# EAGLE design PCB1 (EAGLE 9.3.0)
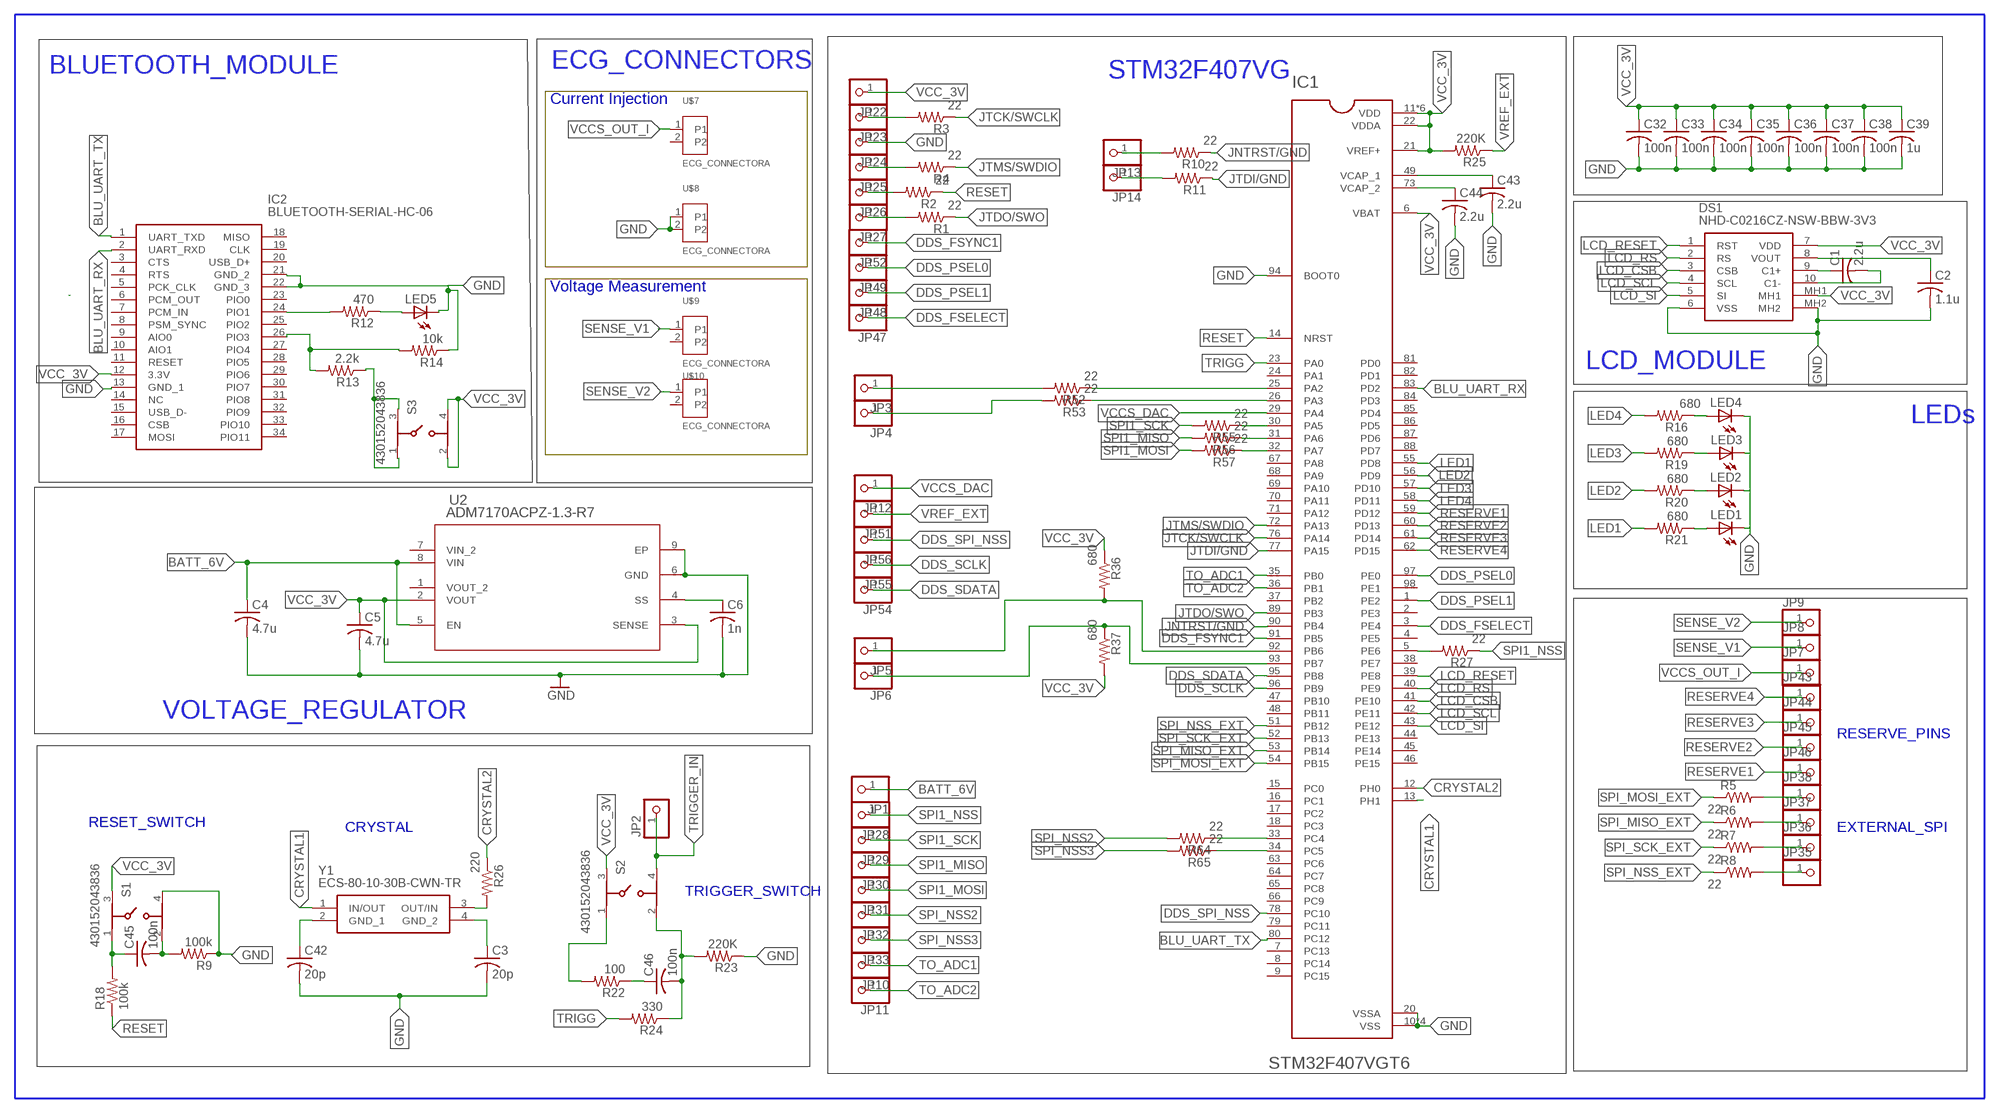
[diagram p0: schematic, sheet 1]

## Parts
C1  2.2u  C-USC0603  [C0603]
C2  1.1u  C-USC0603  [C0603]
C3  20p  C-USC0603  [C0603]
C4  4.7u  C-USC0603  [C0603]
C5  4.7u  C-USC0603  [C0603]
C6  1n  C-USC0603  [C0603]
C32  100n  C-USC0603  [C0603]
C33  100n  C-USC0603  [C0603]
C34  100n  C-USC0603  [C0603]
C35  100n  C-USC0603  [C0603]
C36  100n  C-USC0603  [C0603]
C37  100n  C-USC0603  [C0603]
C38  100n  C-USC0603  [C0603]
C39  1u  C-USC0603  [C0603]
C42  20p  C-USC0603  [C0603]
C43  2.2u  C-USC0603  [C0603]
C44  2.2u  C-USC0603  [C0603]
C45  100n  C-USC0603  [C0603]
C46  100n  C-USC0603  [C0603]
DS1  NHD-C0216CZ-NSW-BBW-3V3  [NHDC0216CZNSWBBW3V3]
IC1  STM32F407VGT6  [QFP50P1600X1600X160-100N]
IC2  BLUETOOTH-SERIAL-HC-06  [BLUETOOTHSERIALHC06]
JP1  PINHD-1X1  [1X01]
JP2  PINHD-1X1  [1X01]
JP3  PINHD-1X1  [1X01]
JP4  PINHD-1X1  [1X01]
JP5  PINHD-1X1  [1X01]
JP6  PINHD-1X1  [1X01]
JP7  PINHD-1X1  [1X01]
JP8  PINHD-1X1  [1X01]
JP9  PINHD-1X1  [1X01]
JP10  PINHD-1X1  [1X01]
JP11  PINHD-1X1  [1X01]
JP12  PINHD-1X1  [1X01]
JP13  PINHD-1X1  [1X01]
JP14  PINHD-1X1  [1X01]
JP22  PINHD-1X1  [1X01]
JP23  PINHD-1X1  [1X01]
JP24  PINHD-1X1  [1X01]
JP25  PINHD-1X1  [1X01]
JP26  PINHD-1X1  [1X01]
JP27  PINHD-1X1  [1X01]
JP28  PINHD-1X1  [1X01]
JP29  PINHD-1X1  [1X01]
JP30  PINHD-1X1  [1X01]
JP31  PINHD-1X1  [1X01]
JP32  PINHD-1X1  [1X01]
JP33  PINHD-1X1  [1X01]
JP35  PINHD-1X1  [1X01]
JP36  PINHD-1X1  [1X01]
JP37  PINHD-1X1  [1X01]
JP38  PINHD-1X1  [1X01]
JP43  PINHD-1X1  [1X01]
JP44  PINHD-1X1  [1X01]
JP45  PINHD-1X1  [1X01]
JP46  PINHD-1X1  [1X01]
JP47  PINHD-1X1  [1X01]
JP48  PINHD-1X1  [1X01]
JP49  PINHD-1X1  [1X01]
JP51  PINHD-1X1  [1X01]
JP52  PINHD-1X1  [1X01]
JP54  PINHD-1X1  [1X01]
JP55  PINHD-1X1  [1X01]
JP56  PINHD-1X1  [1X01]
LED1  LEDCHIPLED_1206  [CHIPLED_1206]
LED2  LEDCHIPLED_1206  [CHIPLED_1206]
LED3  LEDCHIPLED_1206  [CHIPLED_1206]
LED4  LEDCHIPLED_1206  [CHIPLED_1206]
LED5  LEDCHIPLED_1206  [CHIPLED_1206]
R1  22  R-US_R0603  [R0603]
R2  22  R-US_R0603  [R0603]
R3  22  R-US_R0603  [R0603]
R4  22  R-US_R0603  [R0603]
R5  22  R-US_R0603  [R0603]
R6  22  R-US_R0603  [R0603]
R7  22  R-US_R0603  [R0603]
R8  22  R-US_R0603  [R0603]
R9  100k  R-US_R0603  [R0603]
R10  22  R-US_R0603  [R0603]
R11  22  R-US_R0603  [R0603]
R12  470  R-US_R0603  [R0603]
R13  2.2k  R-US_R0603  [R0603]
R14  10k  R-US_R0603  [R0603]
R16  680  R-US_R0603  [R0603]
R18  100k  R-US_R0603  [R0603]
R19  680  R-US_R0603  [R0603]
R20  680  R-US_R0603  [R0603]
R21  680  R-US_R0603  [R0603]
R22  100  R-US_R0603  [R0603]
R23  220K  R-US_R0603  [R0603]
R24  330  R-US_R0603  [R0603]
R25  220K  R-US_R0603  [R0603]
R26  220  R-US_R0603  [R0603]
R27  22  R-US_R0603  [R0603]
R36  680  R-US_R0603  [R0603]
R37  680  R-US_R0603  [R0603]
R52  22  R-US_R0603  [R0603]
R53  22  R-US_R0603  [R0603]
R55  22  R-US_R0603  [R0603]
R56  22  R-US_R0603  [R0603]
R57  22  R-US_R0603  [R0603]
R64  22  R-US_R0603  [R0603]
R65  22  R-US_R0603  [R0603]
S1  430152043836  [430152043836]
S2  430152043836  [430152043836]
S3  430152043836  [430152043836]
U2  ADM7170ACPZ-1.3-R7  [CP_8_21]
U$7  ECG_CONNECTORA  [ECG_CONNECTOR]
U$8  ECG_CONNECTORA  [ECG_CONNECTOR]
U$9  ECG_CONNECTORA  [ECG_CONNECTOR]
U$10  ECG_CONNECTORA  [ECG_CONNECTOR]
Y1  ECS-80-10-30B-CWN-TR  [ECS801830BAGNTR]

## Nets
BATT_6V: C4.1 JP1.1 U2.5(EN) U2.8(VIN)
BLU_UART_RX: IC1.83(PD2) IC2.2(UART_RXD)
BLU_UART_TX: IC1.80(PC12) IC2.1(UART_TXD)
CRYSTAL1: IC1.13(PH1) Y1.1(IN/OUT)
CRYSTAL2: IC1.12(PH0) R26.1
DDS_FSELECT: IC1.3(PE4) JP47.1
DDS_FSYNC1: IC1.91(PB5) JP52.1
DDS_PSEL0: IC1.97(PE0) JP49.1
DDS_PSEL1: IC1.1(PE2) JP48.1
DDS_SCLK: IC1.96(PB9) JP55.1
DDS_SDATA: IC1.95(PB8) JP54.1
DDS_SPI_NSS: IC1.78(PC10) JP56.1
GND: C2.2 C3.2 C4.2 C5.2 C6.2 C32.2 C33.2 C34.2 C35.2 C36.2 C37.2 C38.2 C39.2 C42.1 C42.2 C43.2 C44.2 DS1.6(VSS) DS1.MH2 IC1.10(VSS) IC1.20(VSSA) IC1.27(VSS) IC1.74(VSS) IC1.94(BOOT0) IC1.99(VSS) IC2.13(GND_1) IC2.21(GND_2) IC2.22(GND_3) JP24.1 LED1.C LED2.C LED3.C LED4.C LED5.C R9.1 R14.1 R23.1 S1.4 U2.6(GND) U2.9(EP) U$8.1 U$8.2 Y1.2(GND_1)
I2C_SCL: IC1.92(PB6) JP5.1 R36.2
I2C_SDA: IC1.93(PB7) JP6.1 R37.1
JNTRST/GND: IC1.90(PB4) R10.1
JTCK/SWCLK: IC1.76(PA14) R3.1
JTDI/GND: IC1.77(PA15) R11.1
JTDO/SWO: IC1.89(PB3) R1.1
JTMS/SWDIO: IC1.72(PA13) R4.1
LCD_CSB: DS1.3(CSB) IC1.41(PE10)
LCD_RESET: DS1.1(RST) IC1.39(PE8)
LCD_RS: DS1.2(RS) IC1.40(PE9)
LCD_SCL: DS1.4(SCL) IC1.42(PE11)
LCD_SI: DS1.5(SI) IC1.43(PE12)
LED1: IC1.55(PD8) R21.2
LED2: IC1.56(PD9) R20.2
LED3: IC1.57(PD10) R19.2
LED4: IC1.58(PD11) R16.2
N$1: JP27.1 R1.2
N$2: C1.1 DS1.9(C1+)
N$3: C45.2 R9.2 S1.2
N$4: C1.2 DS1.10(C1-)
N$5: JP26.1 R2.2
N$6: JP25.1 R4.2
N$7: JP13.1 R10.2
N$8: JP23.1 R3.2
N$9: C2.1 DS1.8(VOUT)
N$10: JP35.1 R8.2
N$11: C6.1 U2.4(SS)
N$13: JP36.1 R7.2
N$14: JP37.1 R6.2
N$15: JP38.1 R5.2
N$16: JP14.1 R11.2
N$18: R13.1 S3.1 S3.3
N$19: LED2.A R20.1
N$20: LED3.A R19.1
N$21: LED4.A R16.1
N$22: LED1.A R21.1
N$23: IC2.24(PIO1) R12.2
N$24: LED5.A R12.1
N$25: R22.2 S2.1
N$26: IC1.5(PE6) R27.2
N$27: C46.1 R22.1
N$28: C43.1 IC1.49(VCAP_1)
N$29: C44.1 IC1.73(VCAP_2)
N$30: C46.2 R23.2 R24.1 S2.2
N$31: C45.1 R18.2 S1.1
N$32: C3.1 Y1.4(GND_2)
N$33: R26.2 Y1.3(OUT/IN)
N$34: IC2.26(PIO3) R13.2 R14.2
N$41: JP3.1 R52.2
N$42: JP4.1 R53.2
N$47: IC1.25(PA2) R52.1
N$48: IC1.26(PA3) R53.1
N$50: IC1.33(PC4) R64.1
N$51: IC1.30(PA5) R55.1
N$54: IC1.31(PA6) R56.1
N$55: IC1.32(PA7) R57.1
N$57: IC1.34(PC5) R65.1
RESERVE1: IC1.59(PD12) JP46.1
RESERVE2: IC1.60(PD13) JP45.1
RESERVE3: IC1.61(PD14) JP44.1
RESERVE4: IC1.62(PD15) JP43.1
RESET: IC1.14(NRST) R2.1 R18.1
SENSE_V1: JP8.1 U$9.1
SENSE_V2: JP9.1 U$10.1
SPI1_MISO: JP30.1 R56.2
SPI1_MOSI: JP31.1 R57.2
SPI1_NSS: JP28.1 R27.1
SPI1_SCK: JP29.1 R55.2
SPI_MISO_EXT: IC1.53(PB14) R6.1
SPI_MOSI_EXT: IC1.54(PB15) R5.1
SPI_NSS2: JP32.1 R64.2
SPI_NSS3: JP33.1 R65.2
SPI_NSS_EXT: IC1.51(PB12) R8.1
SPI_SCK_EXT: IC1.52(PB13) R7.1
TO_ADC1: IC1.35(PB0) JP10.1
TO_ADC2: IC1.36(PB1) JP11.1
TRIGG: IC1.23(PA0) R24.2
TRIGGER_IN: JP2.1 S2.4
VCC_3V: C5.1 C32.1 C33.1 C34.1 C35.1 C36.1 C37.1 C38.1 C39.1 DS1.7(VDD) DS1.MH1 IC1.6(VBAT) IC1.11(VDD) IC1.19(VDD) IC1.21(VREF+) IC1.22(VDDA) IC1.28(VDD) IC1.50(VDD) IC1.75(VDD) IC1.100(VDD) IC2.12(3.3V) JP22.1 R25.2 R36.1 R37.2 S1.3 S2.3 S3.2 S3.4 U2.2(VOUT) U2.3(SENSE)
VCCS_DAC: IC1.29(PA4) JP12.1
VCCS_OUT_I: JP7.1 U$7.1
VREF_EXT: JP51.1 R25.1
Unconnected: IC1.2(PE3) IC1.4(PE5) IC1.7(PC13) IC1.8(PC14) IC1.9(PC15) IC1.15(PC0) IC1.16(PC1) IC1.17(PC2) IC1.18(PC3) IC1.24(PA1) IC1.37(PB2) IC1.38(PE7) IC1.44(PE13) IC1.45(PE14) IC1.46(PE15) IC1.47(PB10) IC1.48(PB11) IC1.63(PC6) IC1.64(PC7) IC1.65(PC8) IC1.66(PC9) IC1.67(PA8) IC1.68(PA9) IC1.69(PA10) IC1.70(PA11) IC1.71(PA12) IC1.79(PC11) IC1.81(PD0) IC1.82(PD1) IC1.84(PD3) IC1.85(PD4) IC1.86(PD5) IC1.87(PD6) IC1.88(PD7) IC1.98(PE1) IC2.3(CTS) IC2.4(RTS) IC2.5(PCK_CLK) IC2.6(PCM_OUT) IC2.7(PCM_IN) IC2.8(PSM_SYNC) IC2.9(AIO0) IC2.10(AIO1) IC2.11(RESET) IC2.14(NC) IC2.15(USB_D-) IC2.16(CSB) IC2.17(MOSI) IC2.18(MISO) IC2.19(CLK) IC2.20(USB_D+) IC2.23(PIO0) IC2.25(PIO2) IC2.27(PIO4) IC2.28(PIO5) IC2.29(PIO6) IC2.30(PIO7) IC2.31(PIO8) IC2.32(PIO9) IC2.33(PIO10) IC2.34(PIO11) U2.1(VOUT_2) U2.7(VIN_2) U$7.2 U$9.2 U$10.2

## Notes on the sheet
- BLUETOOTH_MODULE | ECG_CONNECTORS
- STM32F407VG
- Current Injection
- Voltage Measurement
- LCD_MODULE
- LEDs
- VOLTAGE_REGULATOR
- RESERVE_PINS
- RESET_SWITCH
- CRYSTAL | EXTERNAL_SPI
- TRIGGER_SWITCH

## Library data of the parts
C1-C6 C42-C46 = adafruit:C-US: CAPACITOR, American symbol
C32-C39 = adafruit:C-US: CAPACITOR, American symbol; SPICEPREFIX: C
DS1 = SamacSys_Parts:NHD-C0216CZ-NSW-BBW-3V3: LCD Character Display Modules & Accessories STN-BLUE Transm 41.4 x 24.3 x 4.0 Source: Datasheet <https://componentsearchengine.com/Datasheets/1/NHD-C0216CZ-NSW-BBW-3V3.pdf>; DESCRIPTION: LCD Character Display Modules & Accessories STN-BLUE Transm 41.4 x 24.3 x 4.0; HEIGHT: 5.2mm; MANUFACTURER_NAME: Newhaven Display; MANUFACTURER_PART_NUMBER: NHD-C0216CZ-NSW-BBW-3V3; MOUSER_PART_NUMBER: 763-C0216CZ-NSWBBW3V; MOUSER_PRICE-STOCK: https://www.mouser.com/Search/Refine.aspx?Keyword=763-C0216CZ-NSWBBW3V
IC1 = STM32F407VGT6:STM32F407VGT6: STM32 Series 32-bit 1 MB Flash 192 kB RAM ARM Based Microcontroller - LQFP-100; AVAILABILITY: Unavailable; DESCRIPTION: STM32 Series 32-bit 1 MB Flash 192 kB RAM ARM Based Microcontroller - LQFP-100; MF: STMicroelectronics; MP: STM32F407VGT6; PACKAGE: LQFP-100 STMicroelectronics; PRICE: None
IC2 = SamacSys_Parts:BLUETOOTH-SERIAL-HC-06: Bluetooth / 802.15.1 Modules BLUETOOTH-SERIAL-HC-06 Source: Datasheet <https://componentsearchengine.com/Datasheets/1/BLUETOOTH-SERIAL-HC-06.pdf>; DESCRIPTION: Bluetooth / 802.15.1 Modules BLUETOOTH-SERIAL-HC-06; HEIGHT: 2mm; MANUFACTURER_NAME: Olimex Ltd.; MANUFACTURER_PART_NUMBER: BLUETOOTH-SERIAL-HC-06; MOUSER_PART_NUMBER: 909-BLE-SERIAL-HC-06; MOUSER_PRICE-STOCK: https://www.mouser.com/Search/Refine.aspx?Keyword=909-BLE-SERIAL-HC-06
JP1-JP14 JP22-JP33 JP47-JP49 JP51 JP52 JP54-JP56 = adafruit:PINHD-1X1: Pin header 1x1 for 0.1" spacing With round pins
JP35-JP38 JP43-JP46 = adafruit:PINHD-1X1: Pin header 1x1 for 0.1" spacing With round pins; SPICEPREFIX: X
LED1-LED5 = adafruit:LED: LED OSRAM: - CHIPLED LG R971, LG N971, LY N971, LG Q971, LY Q971, LO R971, LY R971 LH N974, LH R974 LS Q976, LO Q976, LY Q976 LO Q996 - Hyper CHIPLED LW Q18S LB Q993, LB Q99A, LB R99A - SideLED LS A670, LO A670, LY A670, LG A670, LP A670 LB A673, LV A673, LT A673, LW A673 LH A674 LY A675 LS A676, LA A676, LO A676, LY A676, LW A676 LS A679, LY A679, LG A679 - Hyper Micro SIDELED® LS Y876, LA Y876, LO Y876, LY Y876 LT Y87S - SmartLED LW L88C, LW L88S LB L89C, LB L89S, LG L890 LS L89K, LO L89K, LY L89K LS L896, LA L896, LO L896, LY L896 - TOPLED LS T670, LO T670, LY T670, LG T670, LP T670 LSG T670, LSP T670, LSY T670, LOP T670, LYG T670 LG T671, LOG T671, LSG T671 LB T673, LV T673, LT T673, LW T673 LH T674 LS T676, LA T676, LO T676, LY T676, LB T676, LH T676, LSB T676, LW T676 LB T67C, LV T67C, LT T67C, LS T67K, LO T67K, LY T67K, LW E67C LS E67B, LA E67B, LO E67B, LY E67B, LB E67C, LV E67C, LT E67C LW T67C LS T679, LY T679, LG T679 LS T770, LO T770, LY T770, LG T770, LP T770 LB T773, LV T773, LT T773, LW T773 LH T774 LS E675, LA E675, LY E675, LS T675 LS T776, LA T776, LO T776, LY T776, LB T776 LHGB T686 LT T68C, LB T68C - Hyper Mini TOPLED® LB M676 - Mini TOPLED Santana® LG M470 LS M47K, LO M47K, LY M47K Source: http://www.osram.convergy.de/
R1-R4 R9-R14 R16 R18-R27 R36 R37 R52 R53 R55-R57 R64 R65 = adafruit:R-US_: RESISTOR, American symbol
R5-R8 = adafruit:R-US_: RESISTOR, American symbol; SPICEPREFIX: R
S1-S3 = WurthTactSwitch:430152043836: 6x6 mm SMD WS-TASV <http://katalog.we-online.de/media/images/v2/Family_WS-TASV_6x6mm_SMD_Tact_Switch_4301820xx8xx.jpg> Details see: http://katalog.we-online.de/em/datasheet/4301x2xxx8x6.pdf 2015 (C) Würth Elektronik; AVAILABILITY: Unavailable; DESCRIPTION: SWITCH TACTILE SPST-NO 0.05A 12V; MF: Wurth Electronics Inc.; MP: 430152043836; PACKAGE: None; PRICE: None
U2 = ADM7170:ADM7170ACPZ-1.3-R7; MANUFACTURER_PART_NUMBER: ADM7170ACPZ1.3R7; VENDOR: Analog Devices Inc
U$7-U$10 = ECG_CONNECTOR:ECG_CONNECTOR
Y1 = SamacSys_Parts:ECS-80-10-30B-CWN-TR: Crystals 8MHz 10ppm 10pF -40C +85C Source: Datasheet <https://componentsearchengine.com/Datasheets/1/ECS-80-10-30B-CWN-TR.pdf>; DESCRIPTION: Crystals 8MHz 10ppm 10pF -40C +85C; HEIGHT: 0.85mm; MANUFACTURER_NAME: ECS; MANUFACTURER_PART_NUMBER: ECS-80-10-30B-CWN-TR; MOUSER_PART_NUMBER: 520-80-10-30B-CWNT; MOUSER_PRICE-STOCK: https://www.mouser.com/Search/Refine.aspx?Keyword=520-80-10-30B-CWNT

## Net classes
0 default: width 0.305 mm

## Board
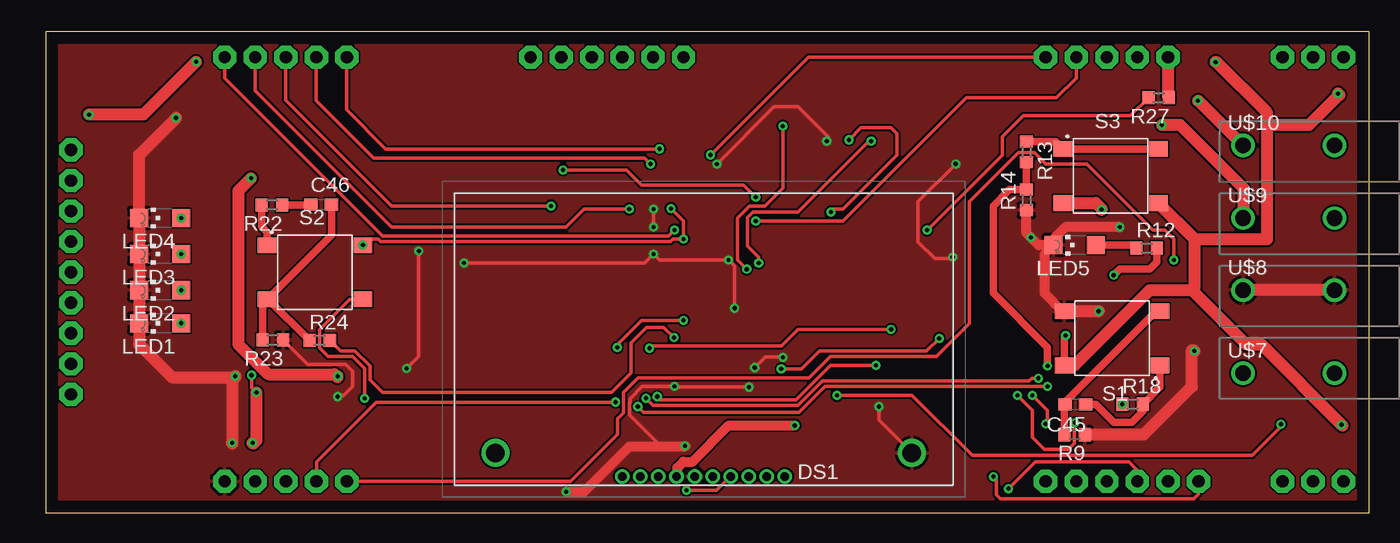
[diagram p1: board, top side]
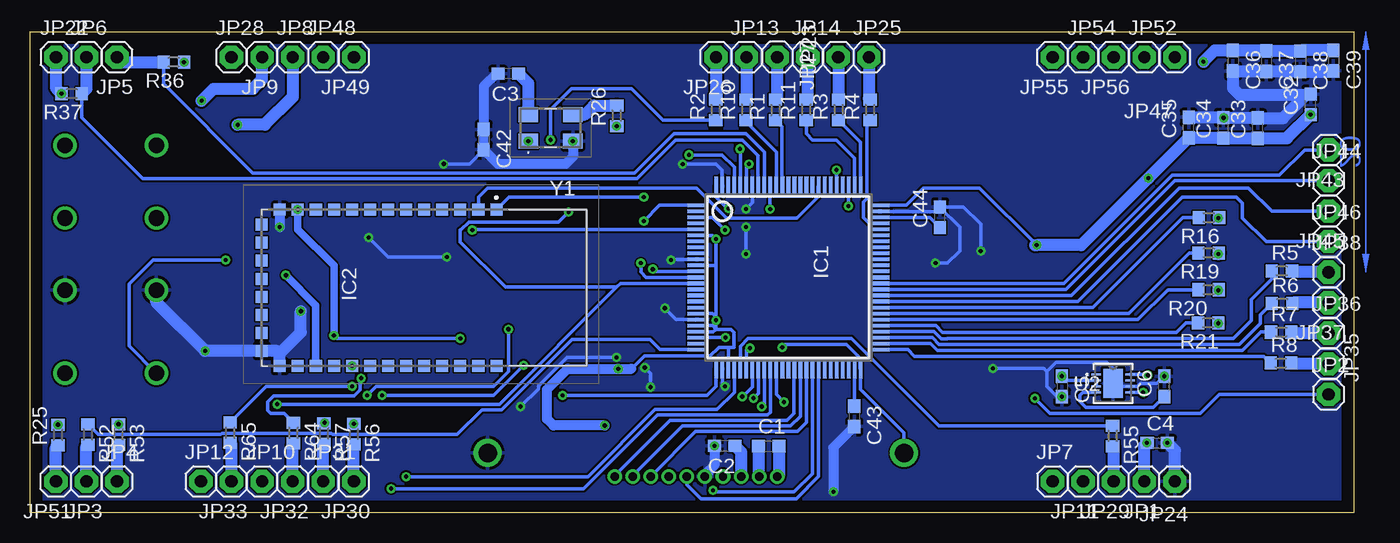
[diagram p2: board, bottom side, seen from below]

Size 110 x 40 mm. Coordinates in mm from the lower left corner, seen from the top.
Outline: 0,0 110,0 110,40 0,40 0,0
Copper layers (1*16): Top 0.035mm / dielectric 1.5mm / Bottom 0.035mm
Design rules "default": minimum track width 6mil, minimum drill 0.35mm, track to track 6mil, track to pad 6mil, pad to pad 6mil, via to via 6mil, smd to smd 6mil, copper to edge 40mil, drill to drill 6mil, minimum pad ring 10mil, minimum via ring 8mil, stop-mask expansion 4mil, vias tented up to drill 0mil, thermal gap 10mil

### Footprints (pad centres in the part's own frame; a part is rotated, then mirrored left to right if it is on the bottom)
C0603 = smd 1.1 x 1: 1 -0.85,0; 2 0.85,0
NHDC0216CZNSWBBW3V3 = drill 0.7 pad 1.2: 1 0,0; 2 -1.5,0; 3 -3,0; 4 -4.5,0; 5 -6,0; 6 -7.5,0; 7 -9,0; 8 -10.5,0; 9 -12,0; 10 -13.5,0 | drill 1.54 pad 2.31: MH1 -24.05,1.95; MH2 10.55,1.95
QFP50P1600X1600X160-100N = smd 0.3 x 1.6: 1 -6,-7.6; 2 -5.5,-7.6; 3 -5,-7.6; 4 -4.5,-7.6; 5 -4,-7.6; 6 -3.5,-7.6; 7 -3,-7.6; 8 -2.5,-7.6; 9 -2,-7.6; 10 -1.5,-7.6; 11 -1,-7.6; 12 -0.5,-7.6; 13 0,-7.6; 14 0.5,-7.6; 15 1,-7.6; 16 1.5,-7.6; 17 2,-7.6; 18 2.5,-7.6; 19 3,-7.6; 20 3.5,-7.6; 21 4,-7.6; 22 4.5,-7.6; 23 5,-7.6; 24 5.5,-7.6; 25 6,-7.6; 51 6,7.6; 52 5.5,7.6; 53 5,7.6; 54 4.5,7.6; 55 4,7.6; 56 3.5,7.6; 57 3,7.6; 58 2.5,7.6; 59 2,7.6; 60 1.5,7.6; 61 1,7.6; 62 0.5,7.6; 63 0,7.6; 64 -0.5,7.6; 65 -1,7.6; 66 -1.5,7.6; 67 -2,7.6; 68 -2.5,7.6; 69 -3,7.6; 70 -3.5,7.6; 71 -4,7.6; 72 -4.5,7.6; 73 -5,7.6; 74 -5.5,7.6; 75 -6,7.6 | smd 1.6 x 0.3: 26 7.6,-6; 27 7.6,-5.5; 28 7.6,-5; 29 7.6,-4.5; 30 7.6,-4; 31 7.6,-3.5; 32 7.6,-3; 33 7.6,-2.5; 34 7.6,-2; 35 7.6,-1.5; 36 7.6,-1; 37 7.6,-0.5; 38 7.6,0; 39 7.6,0.5; 40 7.6,1; 41 7.6,1.5; 42 7.6,2; 43 7.6,2.5; 44 7.6,3; 45 7.6,3.5; 46 7.6,4; 47 7.6,4.5; 48 7.6,5; 49 7.6,5.5; 50 7.6,6; 76 -7.6,6; 77 -7.6,5.5; 78 -7.6,5; 79 -7.6,4.5; 80 -7.6,4; 81 -7.6,3.5; 82 -7.6,3; 83 -7.6,2.5; 84 -7.6,2; 85 -7.6,1.5; 86 -7.6,1; 87 -7.6,0.5; 88 -7.6,0; 89 -7.6,-0.5; 90 -7.6,-1; 91 -7.6,-1.5; 92 -7.6,-2; 93 -7.6,-2.5; 94 -7.6,-3; 95 -7.6,-3.5; 96 -7.6,-4; 97 -7.6,-4.5; 98 -7.6,-5; 99 -7.6,-5.5; 100 -7.6,-6
BLUETOOTHSERIALHC06 = smd 1 x 1: 1 -6.2,6.25; 2 -6.2,4.75; 3 -6.2,3.25; 4 -6.2,1.75; 5 -6.2,0.25; 6 -6.2,-1.25; 7 -6.2,-2.75; 8 -6.2,-4.25; 9 -6.2,-5.75; 10 -6.2,-7.25; 11 -6.2,-8.75; 12 -6.2,-10.25; 13 -6.2,-11.75; 14 -4.95,-13.25; 15 -3.45,-13.25; 16 -1.95,-13.25; 17 -0.45,-13.25; 18 1.05,-13.25; 19 2.55,-13.25; 20 4.05,-13.25; 21 5.55,-13.25; 22 6.8,-11.75; 23 6.8,-10.25; 24 6.8,-8.75; 25 6.8,-7.25; 26 6.8,-5.75; 27 6.8,-4.25; 28 6.8,-2.75; 29 6.8,-1.25; 30 6.8,0.25; 31 6.8,1.75; 32 6.8,3.25; 33 6.8,4.75; 34 6.8,6.25
1X01 = drill 1.016 pad 1.93 octagon: 1 0,0
CHIPLED_1206 = smd 1.5 x 1.5: A 0,-1.75; C 0,1.75
R0603 = smd 1 x 1.1: 1 -0.85,0; 2 0.85,0
430152043836 = smd 1.55 x 1.3: 1 -3.975,2.25; 2 -3.975,-2.25; 3 3.975,2.25; 4 3.975,-2.25
CP_8_21 = smd 0.805 x 0.198: 1 -1.402,0.75; 2 -1.402,0.25; 3 -1.402,-0.25; 4 -1.402,-0.75; 5 1.402,-0.75; 6 1.402,-0.25; 7 1.402,0.25; 8 1.402,0.75 | smd 1.6 x 2.44: 9 0,0
ECG_CONNECTOR = drill 1.3: 1 0,0; 2 7.6,0
ECS801830BAGNTR = smd 1.6 x 1.25: 1 -1.85,-1.1; 2 1.85,-1.1; 3 1.85,1.1; 4 -1.85,1.1

### Placement (x,y rotation side)
C1  48.62,5.54 0 bottom
C2  52.27,5.55 180 bottom
C3  70.25,36.5 180 bottom
C4  16.34,5.8 0 bottom
C5  24.25,10.5 270 bottom
C6  15.75,10.5 90 bottom
C32  3.59,33.95 90 bottom
C33  7.96,31.98 90 bottom
C34  10.84,32 90 bottom
C35  13.71,32.02 90 bottom
C36  10.04,37.58 270 bottom
C37  7.29,37.55 270 bottom
C38  4.43,37.53 270 bottom
C39  1.69,37.59 270 bottom
C42  72.3,31.02 270 bottom
C43  41.52,8.02 270 bottom
C44  34.39,24.57 90 bottom
C45  85.57,9 180 top
C46  22.89,25.62 0 top
DS1  61.42,3.02 0 top
IC1  46.98,19.56 270 bottom
IC2  77.5,19 270 bottom
JP1  17.41,2.6 180 bottom
JP2  2.1,9.84 0 bottom
JP3  105.31,2.6 180 bottom
JP4  102.78,2.6 0 bottom
JP5  102.78,37.88 180 bottom
JP6  105.31,37.88 0 bottom
JP7  25.03,2.6 0 bottom
JP8  88.18,37.88 0 bottom
JP9  90.72,37.88 180 bottom
JP10  90.72,2.6 0 bottom
JP11  22.49,2.6 180 bottom
JP12  95.8,2.6 0 bottom
JP13  50.46,37.88 0 bottom
JP14  45.38,37.88 0 bottom
JP22  107.86,37.88 0 bottom
JP23  42.84,37.88 90 bottom
JP24  14.87,2.6 180 bottom
JP25  40.3,37.88 0 bottom
JP26  53,37.88 180 bottom
JP27  47.92,37.88 270 bottom
JP28  93.26,37.88 0 bottom
JP29  19.95,2.6 180 bottom
JP30  83.1,2.6 180 bottom
JP31  85.64,2.6 0 bottom
JP32  88.18,2.6 180 bottom
JP33  93.26,2.6 180 bottom
JP35  2.1,12.38 180 bottom
JP36  2.1,14.92 0 bottom
JP37  2.1,17.46 180 bottom
JP38  2.1,20 0 bottom
JP43  2.1,30.16 180 bottom
JP44  2.1,27.62 0 bottom
JP45  2.1,25.08 180 bottom
JP46  2.1,22.54 0 bottom
JP47  14.87,37.88 180 bottom
JP48  85.64,37.88 0 bottom
JP49  83.1,37.88 180 bottom
JP51  107.86,2.6 180 bottom
JP52  17.41,37.88 0 bottom
JP54  22.49,37.88 0 bottom
JP55  25.03,37.88 180 bottom
JP56  19.95,37.88 180 bottom
LED1  9.5,15.75 90 top
LED2  9.5,18.5 90 top
LED3  9.5,21.5 90 top
LED4  9.5,24.5 90 top
LED5  85.5,22.25 90 top
R1  48.05,33.48 90 bottom
R2  53.03,33.49 90 bottom
R3  42.81,33.49 90 bottom
R4  40.19,33.49 90 bottom
R5  5.98,20.11 0 bottom
R6  5.95,17.41 0 bottom
R7  6.03,15.02 0 bottom
R8  6.05,12.45 0 bottom
R9  85.5,6.5 180 top
R10  50.5,33.5 90 bottom
R11  45.5,33.5 90 bottom
R12  91.5,22 0 top
R13  81.5,30 270 top
R14  81.5,26 90 top
R16  12.03,24.54 180 bottom
R18  90.32,9.02 0 top
R19  12.05,21.6 180 bottom
R20  12.07,18.54 180 bottom
R21  12.09,15.79 180 bottom
R22  18.8,25.59 180 top
R23  18.86,14.37 180 top
R24  22.77,14.33 0 top
R25  107.68,6.47 90 bottom
R26  61.25,33 90 bottom
R27  92.5,34.5 180 top
R36  98.06,37.47 180 bottom
R37  106.54,34.85 180 bottom
R52  105.19,6.5 270 bottom
R53  102.65,6.51 270 bottom
R55  20.04,6.38 270 bottom
R56  83.1,6.54 270 bottom
R57  85.58,6.58 270 bottom
R64  88.11,6.63 270 bottom
R65  93.37,6.65 270 bottom
S1  88.62,14.5 180 top
S2  22.38,20 0 top
S3  88.5,28 0 top
U2  20,10.75 0 bottom
U$7  99.5,11.6 0 top
U$8  99.5,18.5 0 top
U$9  99.5,24.5 0 top
U$10  99.5,30.54 0 top
Y1  66.75,32 0 bottom

### Tracks (layer width: path | path; a pad name or v marks a point on that pad's centre or on a via)
BATT_6V  (via drill 0.35)
  Top 0.305: v17.5,10 17.12,10.38 17.12,11.41 v17.1,11.43
  Top 1.016: v17.5,10 17.5,6 17.25,5.75 C4.1 v17.18,5.8
  Bottom 0.305: U2.5 v17.5,10 | v17.1,11.43 17.16,11.5 U2.8
  Bottom 1.016: JP1.1 17.41,5.58 v17.18,5.8
BLU_UART_RX
  Bottom 0.305: IC1.83 44.52,27.11 44.52,26.23 46.26,24.5 52.14,24.5 54.64,27 72,27 72.75,26.25 IC2.2
BLU_UART_TX  (via drill 0.35)
  Top 0.305: v43,28.5 48.25,28.5 49.5,27.25 58,27.25 v59,26.25
  Bottom 0.305: IC2.1 70.2,26.25 v59,26.25 | 43,27.14 IC1.80 42.98,28.48 v43,28.5
CRYSTAL1  (via drill 0.35)
  Top 0.305: v59.25,20.75 59.25,21.25 58.32,22.18 58.32,24.53 58.78,25 62.5,25 68.5,31 Y1.1
  Bottom 0.305: IC1.13 58.81,19.56 59.25,20 v59.25,20.75
  other vias: 68.6,30.9
CRYSTAL2  (via drill 0.35)
  Top 0.305: v58.25,20.25 57.5,21 57.5,24.5 58.5,25.5 59.75,25.5 61.25,27 R26.1 61.25,32.25
  Bottom 0.305: IC1.12 58.06,20.06 v58.25,20.25
  other vias: 61.25,32.15
DDS_FSELECT  (via drill 0.35)
  Top 0.305: JP47.1 14.87,36.13 28,23 51.75,23 v52.25,23.5
  Bottom 0.305: v52.25,23.5 53.31,24.56 IC1.3
DDS_FSYNC1  (via drill 0.35)
  Top 0.305: JP52.1 17.41,35.09 28.75,23.75 43.25,23.75 44.75,25.25 v48.5,25.25
  Bottom 0.305: IC1.91 48.5,27.14 v48.5,25.25
DDS_PSEL0  (via drill 0.35)
  Top 0.305: v55.25,29.75 63.38,37.88 JP49.1
  Bottom 0.305: IC1.97 51.48,28.73 52.5,29.75 v55.25,29.75
DDS_PSEL1  (via drill 0.35)
  Top 0.305: v59,24.25 66.25,24.25 76.5,34.5 84,34.5 85.64,36.14 JP48.1
  Bottom 0.305: IC1.1 57.69,25.56 v59,24.25
DDS_SCLK  (via drill 0.35)
  Top 0.305: JP55.1 25,37.34 25,33.5 28.25,30.25 v51,30.25
  Bottom 0.305: v51,30.25 50.98,30.23 IC1.96
DDS_SDATA  (via drill 0.35)
  Top 0.305: v50.25,29 49.75,29.5 27.25,29.5 22.49,34.26 JP54.1
  Bottom 0.305: IC1.95 50.48,28.77 v50.25,29
DDS_SPI_NSS  (via drill 0.35)
  Top 0.305: v42,25.5 28.75,25.5 19.95,34.3 JP56.1
  Bottom 0.305: IC1.78 42,27.14 v42,25.5
GND  (via drill 0.35)
  Top 0.305: R23.1 21.77,12.31 24.94,12.31 25.5,11.75 25.5,10.5 24.75,9.75 24.25,9.75 C5.2 | v30,12 31,13 v31,21.75 | v57.25,17 57.25,20.5 v56.75,21 51,21 v50.5,21.5 49.75,20.75 v34.75,20.75 | v50.5,23.75 v50.5,25.25 | v55.77,28.98 60.53,33.75 62.5,33.75 65,31.25 65,31 Y1.2 | v75.62,29 72.5,25.88 72.5,22.5 73.88,21.12 75.38,21.12 v75.38,21.25 | C2.2 51.09,5.55 48.52,8.12 48.52,9.1 48.54,9.13 48.54,9.48 49.56,10.5 v52.26,10.5 52.32,10.44 v58.44,10.44 | DS1.MH2 69.24,7.7 v69.24,8.82 | v61.26,12.9 61.2,12.96 59.82,12.96 v58.92,12.06
  Top 0.813: v89.25,23.75 84.75,23.75 83.75,22.75 LED5.C | LED5.C 82.5,22.25 v81.88,22.88 81.5,23.25 R14.1 | LED5.C 83,21.5 83,18.25 84.5,16.75 S1.4 | v43.25,1.75 44.75,1.75 48.5,5.5 53.08,5.5 C2.2
  Top 1.016: v10.81,32.83 10.82,32.83 7.75,29.75 LED4.C LED3.C LED2.C LED1.C 7.75,14 10.5,11.25 15.75,11.25 C6.2 15.5,11.1 15.5,5.79 | 15.5,5.75 15.5,5.79 | 15.5,5.79 v15.48,5.8 | U$8.2 U$8.1 | v87.5,16.75 S1.4 | R9.1 91.25,6.5 95.25,10.5 95.25,13.5 95.4,13.5 v95.45,13.45
  Bottom 0.305: IC1.74 34.75,25.06 C44.2 | C6.2 16.35,10.75 17.75,10.75 18,10.5 U2.6 19.75,10.5 U2.9 20,12 20.5,12.5 24.75,12.5 25.5,11.75 | C5.2 24.65,9.65 25.5,10.5 25.5,11.75 | 25.5,11.75 25.75,12 v30,12 | v31,21.75 31,24 32.42,25.42 C44.2 | IC1.20 56.31,16.06 v57.25,17 | v56.75,21 56.69,21.06 IC1.10 | v50.5,21.5 v50.5,23.75 | IC1.94 49.98,25.77 v50.5,25.25 | IC1.99 52.5,27.18 52.5,28.5 53,29 55.75,29 v55.77,28.98 | C44.2 34.39,25.39 32.75,23.75 32.75,21.75 33.75,20.75 v34.75,20.75 | C42.2 73.47,29 v75.62,29 | v75.38,21.25 80.25,21.25 v81.88,22.88 | v52.26,10.5 52.48,10.72 IC1.27 | v58.44,10.44 58.44,11.58 v58.92,12.06 | v69.24,8.82 67.75,10.31 67.75,10.54 65.39,12.9 v61.26,12.9
  Bottom 0.813: IC2.13 v89.25,23.75 | C3.2 71.25,36.5 72.3,35.45 C42.1 C42.2 71.13,29 65.5,29 64.9,29.6 Y1.2 | C2.2 53.12,3.96 53.58,3.5 53.58,3.36 DS1.6 | C43.2 43.25,5.43 v43.25,1.75
  Bottom 1.016: C39.2 1.74,36.68 C38.2 4.46,36.7 C37.2 7.31,36.73 C36.2 10.04,35.28 9.5,34.75 3.64,34.75 C32.2 3.89,34.8 5.89,32.8 7.94,32.8 C33.2 v10.81,32.83 C34.2 13.69,32.85 C35.2 | JP24.1 14.87,5.18 v15.48,5.8 | IC2.22 89.25,13.25 | 89.25,13.25 89.45,13.45 IC2.21 v95.45,13.45 99.5,17.5 U$8.1 | 89.25,13.25 87.5,15 v87.5,16.75
  other vias: 15.75,11.35 24.25,9.65 53.12,5.55 64.9,30.9
  pour Bottom: -2,41 -2,-2 112,-2 112,42 -2,42
  pour Top: -2,42 -2,-2 112,-2 112,42
I2C_SCL
  Bottom 0.305: IC1.92 48.98,29.98 50.5,31.5 56.5,31.5 59.75,28.25 91.5,28.25 98.91,35.66 R36.2
  Bottom 1.016: JP5.1 102.36,37.47 R36.2
I2C_SDA
  Bottom 0.305: IC1.93 49.49,27.18 49.49,29.71 50.78,31 56.35,31 59.56,27.79 100.63,27.79 105.69,32.85 R37.1
  Bottom 1.016: JP6.1 105.31,35.23 R37.1
JNTRST/GND
  Bottom 0.305: IC1.90 47.98,29.98 50.5,32.5 R10.1
JTCK/SWCLK
  Bottom 0.305: IC1.76 41,27.18 41,30.83 R3.1
JTDI/GND
  Bottom 0.305: IC1.77 41.48,29.48 43,31 45,31 45.5,31.5 R11.1
JTDO/SWO
  Bottom 0.305: IC1.89 47.5,27.18 47.5,32.09 R1.1
JTMS/SWDIO
  Bottom 0.305: IC1.72 39.42,24.1 40.3,24.1 40.73,24.53 40.73,25.84 40.44,26.13 40.44,32.4 R4.1
LCD_CSB
  Bottom 0.305: IC1.41 45.48,7.52 46.25,6.75 54.69,6.75 DS1.3
LCD_RESET
  Bottom 0.305: IC1.39 46.5,11.94 46.5,8.25 47.09,7.66 56.81,7.66 61.42,3.06 DS1.1
LCD_RS
  Bottom 0.305: IC1.40 45.98,8.02 46.79,7.21 55.77,7.21 59.92,3.06 DS1.2
LCD_SCL  (via drill 0.35)
  Top 0.305: v53.25,1.85 55.75,1.85 DS1.4
  Bottom 0.305: IC1.42 45,11.94 45,3.25 46.5,1.75 53.25,1.75 v53.25,1.85
LCD_SI
  Bottom 0.305: IC1.43 44.48,3.02 46.33,1.17 54.25,1.17 55.42,2.34 DS1.5
LED1
  Bottom 0.305: R21.2 13.96,15.79 14.75,15 34.16,15 34.74,15.58 39.36,15.58 IC1.55
LED2
  Bottom 0.305: R20.2 15.46,18.54 17.94,16.06 IC1.56
LED3
  Bottom 0.305: R19.2 13.65,21.6 18.69,16.56 IC1.57
LED4
  Bottom 0.305: R16.2 14.21,24.54 21.69,17.06 IC1.58
N$1
  Bottom 1.016: JP27.1 47.92,34.47 R1.2
N$2
  Bottom 1.016: C1.1 49.47,3.06 DS1.9
N$3
  Top 0.61: R9.2 84.65,8.93 C45.2 84.72,9.22 92.25,16.75 S1.2
N$4
  Bottom 1.016: C1.2 47.77,3.17 DS1.10
N$5
  Bottom 1.016: JP26.1 53,34.38 R2.2
N$6
  Bottom 1.016: JP25.1 40.3,34.45 R4.2
N$7
  Bottom 1.016: JP13.1 50.46,34.39 R10.2
N$8
  Bottom 1.016: JP23.1 42.84,34.37 R3.2
N$9
  Bottom 1.016: C2.1 50.92,5.04 DS1.8
N$10
  Bottom 1.016: JP35.1 5.14,12.38 R8.2
N$11
  Bottom 0.305: C6.1 16.65,8.75 22.25,8.75 22.75,9.25 22.75,9.75 22.5,10 U2.4
N$13
  Bottom 1.016: JP36.1 5.08,14.92 R7.2
N$14
  Bottom 1.016: JP37.1 5.04,17.46 R6.2
N$15
  Bottom 1.016: JP38.1 5.03,20 R5.2
N$16
  Bottom 1.016: JP14.1 45.38,34.47 R11.2
N$18
  Top 0.61: R13.1 83.92,30.85 S3.1 S3.3
N$19  (via drill 0.35)
  Bottom 1.016: LED2.A R20.1
  other vias: 11.25,18.5
N$20  (via drill 0.35)
  Bottom 1.016: LED3.A 11.25,21.55 R19.1
  other vias: 11.25,21.5
N$21  (via drill 0.35)
  Bottom 1.016: LED4.A 11.21,24.54 R16.1
  other vias: 11.25,24.5
N$22  (via drill 0.35)
  Bottom 1.016: LED1.A 11.25,15.78 R21.1
  other vias: 11.25,15.75
N$23  (via drill 0.35)
  Top 0.61: v88.75,19.75 89.25,20.25 91.75,20.25 92.35,20.85 R12.2
  Bottom 0.61: IC2.24 86.25,17.25 v88.75,19.75
N$24
  Top 0.61: LED5.A 90.4,22.25 R12.1
N$25
  Top 0.61: R22.2 17.95,23.8 18.4,23.35 S2.1
N$26  (via drill 0.35)
  Top 0.305: v73.25,23.5 79.5,29.75 79.5,31.25 81.25,33 90.15,33 R27.2
  Bottom 0.305: IC1.5 73.19,23.56 v73.25,23.5
N$27
  Top 0.61: R22.1 22,25.59 C46.1
N$28
  Bottom 0.305: IC1.49 41.48,8.9 C43.1
N$29
  Bottom 0.305: IC1.73 35.23,24.56 C44.1
N$30
  Top 0.61: C46.2 23.75,23.09 S2.2 | R23.2 18.02,17.36 S2.2 | R24.1 18.5,17.75 S2.2
N$31
  Top 0.61: C45.1 87.25,9 88.75,7.5 90.25,7.5 91.17,8.42 R18.2 92.6,10.45 S1.1
N$32
  Bottom 1.016: C3.1 68.6,35.7 Y1.4
N$33
  Bottom 1.016: Y1.3 63.9,33.1 63.15,33.85 R26.2
N$34  (via drill 0.35)
  Top 0.61: IC2.26 83.25,13.75 78.75,18.25 78.75,25.5 80.1,26.85 R14.2 R13.2
  other vias: 83.25,12.2
N$41
  Bottom 1.016: JP3.1 105.31,5.53 R52.2
N$42
  Bottom 1.016: JP4.1 102.78,5.54 R53.2
N$47
  Bottom 0.305: R52.1 104.33,6.5 94.15,6.5 94.04,6.61 84.98,6.61 84.86,6.5 74.5,6.5 72.46,8.54 70.81,8.54 64.95,14.4 58.48,14.4 57.64,13.56 IC1.25
N$48  (via drill 0.35)
  Top 0.305: v65.75,9.75 72,9.75 77,4.75 100.25,4.75 102.75,7.25 R53.1
  Bottom 0.305: IC1.26 52.98,10.52 53.75,9.75 v65.75,9.75
  other vias: 102.65,7.36
N$50  (via drill 0.35)
  Top 0.305: v49.88,9.52 50.48,8.92 62.52,8.92 64.56,10.96 81.71,10.96 81.93,11.18 v82.48,11.18
  Bottom 0.305: IC1.33 49.48,9.92 v49.88,9.52 | v82.48,11.18 82.57,11.1 82.57,10.22 83.08,9.7 89.75,9.7 90.25,9.21 90.25,8.5 90,8.25 88.89,8.25 R64.1
N$51
  Bottom 0.305: IC1.30 50.98,13.84 50.32,14.5 41.75,14.5 34.48,7.22 R55.1
N$54  (via drill 0.35)
  Top 0.305: v70.25,15.25 62.53,15.25 61.14,13.86 50.36,13.86 v50.18,13.68 | v82,9.75 83.25,8.5 83.25,7.25 83.23,7.25 R56.1
  Bottom 0.305: IC1.31 50.48,13.52 50.25,13.75 v50.18,13.68 | v82,9.75 81.25,10.5 71.5,10.5 70.25,11.75 v70.25,15.25
  other vias: 83.1,7.38
N$55  (via drill 0.35)
  Top 0.305: v50.82,9.65 51.1,9.37 62.33,9.37 65.21,12.25 v69,12.25 | v80.75,9.75 82,8.5 82,6.25 83,5.25 85,5.25 85.5,5.75 85.5,7.5 85.52,7.48 v85.53,7.48
  Bottom 0.305: IC1.32 49.98,10.47 50.8,9.65 v50.82,9.65 | v69,12.25 71.5,9.75 v80.75,9.75 | v85.53,7.48 R57.1
N$57  (via drill 0.35)
  Top 0.305: v49.2,8.82 49.68,8.34 62.59,8.34 64.75,10.5 v83.25,10.5
  Bottom 0.305: IC1.34 48.98,9.04 v49.2,8.82 | v83.25,10.5 90.37,10.5 R65.1
RESERVE1
  Bottom 0.305: JP46.1 7.29,22.54 9.25,24.5 9.25,25.75 9.75,26.25 14.25,26.25 22.94,17.56 IC1.59
RESERVE2
  Bottom 0.305: JP45.1 6.83,25.08 8.75,27 14.5,27 23.45,18.05 39.4,18.05 IC1.60
RESERVE3
  Bottom 0.305: JP44.1 14.88,27.62 23.94,18.56 IC1.61
RESERVE4
  Bottom 0.305: JP43.1 4.09,30.16 6.17,28.08 15.07,28.08 24.09,19.06 IC1.62
RESET  (via drill 0.35)
  Top 0.305: v66.75,31 67.75,32 70.25,32 70.75,31.5 70.75,29.75 66.25,25.25 65.25,25.25 v65.25,25
  Bottom 0.305: IC1.14 60.94,19.06 61.25,18.75 | 61.25,18.75 71,9 89.5,9 R18.1 | R2.1 57.4,32.65 60,35.25 65,35.25 66.75,33.5 v66.75,31 | v65.25,25 66.07,24.18 73.53,24.18 74.22,23.5 74.25,23.5 74.25,22.5 70.5,18.75 61.25,18.75
  other vias: 89.47,9.02
SENSE_V1  (via drill 0.35)
  Top 1.016: v92.75,32.25 94.25,32.25 99.5,27 U$9.1
  Bottom 1.016: JP8.1 88.18,34.57 90.5,32.25 v92.75,32.25
SENSE_V2  (via drill 0.35)
  Top 1.016: U$10.1 95.79,34.25 v95.75,34.25
  Bottom 1.016: v95.75,34.25 94.75,35.25 91.5,35.25 90.72,36.03 JP9.1
SPI1_MISO
  Bottom 1.016: JP30.1 R56.2
SPI1_MOSI
  Bottom 1.016: JP31.1 85.64,5.67 R57.2
SPI1_NSS
  Top 1.016: JP28.1 93.26,34.59 R27.1
SPI1_SCK
  Bottom 1.016: JP29.1 19.95,5.44 R55.2
SPI_MISO_EXT
  Bottom 0.305: R6.1 7.75,16.45 7.75,15.75 9.5,14 34.46,14 35.03,14.58 39.36,14.58 IC1.53
SPI_MOSI_EXT
  Bottom 0.305: R5.1 6.83,19.42 8.5,17.75 8.5,16 10,14.5 33.75,14.5 33.79,14.46 34.27,14.46 34.89,15.08 39.36,15.08 IC1.54
SPI_NSS2
  Bottom 1.016: JP32.1 88.18,5.71 R64.2
SPI_NSS3
  Bottom 1.016: JP33.1 93.26,5.69 R65.2
SPI_NSS_EXT
  Bottom 0.305: IC1.51 37.06,13.56 36.5,13 7.46,13 R8.1
SPI_SCK_EXT
  Bottom 0.305: R7.1 7.74,15.02 9.25,13.5 34.6,13.5 35.18,14.08 39.36,14.08 IC1.52
TO_ADC1  (via drill 0.35)
  Top 0.305: v80,2 82.25,4.25 90,4.25 90.72,3.53 JP10.1
  Bottom 0.305: v80,2 64,2 57.88,8.12 48.72,8.12 48.48,8.36 IC1.35
TO_ADC2  (via drill 0.35)
  Top 0.305: JP11.1 22.5,4.25 27.44,9.19 v47.34,9.19
  Bottom 0.305: v47.34,9.19 47.98,9.83 IC1.36
TRIGG  (via drill 0.35)
  Top 0.305: 23.79,14.5 R24.2 24.49,13.46 25.69,13.46 26.96,12.19 26.96,11.04 28,10 47,10 48.64,11.64 48.64,14.12 49.94,15.42 51.35,15.42 v52.21,14.56
  Bottom 0.305: IC1.23 v52.21,14.56
TRIGGER_IN  (via drill 0.35)
  Top 0.305: v26.5,9.5 26.5,12 25.5,13 23.46,13 22.75,13.71 22.75,15.25 25.25,17.75 S2.4
  Bottom 0.305: JP2.1 11.16,9.84 12.75,8.25 25.25,8.25 v26.5,9.5
VCC_3V  (via drill 0.35)
  Top 0.305: v51.96,25.29 53,24.25 v53,22.75 52.15,22.75 51.94,22.54 27.81,22.54 27.6,22.75 26.85,22.75 S2.3 | v74.25,14.5 73.21,13.46 64.31,13.46 62.81,11.96 v61.12,11.96 | v47.5,13.75 47.5,14 49.5,16 v53,16
  Top 0.61: v84.75,14.75 84.65,14.65 S1.3
  Top 0.813: DS1.7 52.5,3.1 52.5,3.75 53,4.25 53.75,4.25 56.75,7.25 v62.25,7.25
  Top 1.016: v12.5,37.5 8.1,33.1 C32.1 | S1.3 85.5,12.25 91.75,18.5 95.25,18.5 | 95.25,18.5 99.75,14 101,14 R25.2 107.75,7.25 | S3.4 95.47,22.75 | 95.47,22.75 101.5,22.75 101.5,32.25 | 101.5,32.25 101.5,33.25 97.25,37.5 R36.1 | 101.5,32.25 105,32.25 107.5,34.75 R37.2 | 95.25,18.5 95.47,18.73 95.47,22.75 | v17.07,27.82 16,26.75 16,14 18.5,11.5 24,11.5 24.25,11.25 C5.1 | S3.2 87.25,25.75 87.75,25.25 IC2.12
  Bottom 0.305: U2.3 U2.2 23.9,11 C5.1 | DS1.MH1 37.37,6.62 41,10.25 40.98,10.27 IC1.50 41.02,12 41.02,12.88 42.14,14 47.25,14 v47.5,13.75 | S2.3 31.1,27 35.75,27 37.19,25.56 IC1.75 | 52,13.75 52.77,13.75 53.48,13.04 58.94,13.04 60.02,11.96 | 52,13.75 51.5,13.75 51.5,15 51.75,15.25 53,15.25 | 53,15.25 53.23,15.02 54.54,15.02 IC1.22 | IC1.21 53.31,15.56 53,15.25 | 53,15.25 v53,16 53,16.25 | 53,16.25 53.31,16.56 IC1.19 | IC1.11 53.06,20.56 | 53.06,20.56 53,20.5 53,16.25 | IC1.6 53.31,23.06 v53,22.75 53,20.62 53.06,20.56 | IC1.100 52.98,26.23 52,25.25 v51.96,25.29 | v74.25,14.5 84.5,14.5 v84.75,14.75 | IC1.28 51.98,13.73 52,13.75
  Bottom 0.61: v84.75,14.75 84.75,20.55 87.75,23.55 IC2.12
  Bottom 0.813: 60.02,11.96 v61.12,11.96 65.32,11.96 67.04,10.24 67.04,7.79 66.5,7.25 v62.25,7.25
  Bottom 1.016: C39.1 4.38,38.44 C38.1 7.26,38.38 C37.1 10.01,38.4 C36.1 11.57,38.42 v12.5,37.5 | C32.1 5.57,31.12 C33.1 7.99,31.15 C34.1 10.87,31.18 C35.1 v17.07,27.82 22.64,22.25 S2.3 26.5,22.25 | JP22.1 107.86,35.31 R37.2
  other vias: 3.59,33.1 107.68,7.32 97.21,37.47 107.39,34.85 26.35,22.25 24.25,11.35 87.75,25.2
VCCS_DAC  (via drill 0.35)
  Top 0.305: v78.75,3 79,2.75 79,1.5 79.33,1.17 95.42,1.17 95.8,1.55 JP12.1
  Bottom 0.305: IC1.29 51.47,11.95 51.47,10.01 52.9,8.58 58.07,8.58 63.65,3 v78.75,3
VCCS_OUT_I  (via drill 0.35)
  Top 0.305: JP7.1 43.6,2.6 47.5,6.5 47.5,7.78 48.02,8.31 48.02,10.02 49.2,11.2 63.42,11.2 65.22,13 74,13 76.75,15.75 76.75,25.88 80.82,29.95 82.18,29.95 83.13,29 86.5,29 92,23.5 93,23.5 93.75,22.75 v93.75,21
  Bottom 0.305: v93.75,21 99.75,21 101.75,19 101.75,13.85 U$7.1
VREF_EXT
  Bottom 1.016: JP51.1 107.86,5.45 R25.1
(copper drawn outside any net)
  shapes: Bottom area x1